# EAGLE design mowgli-mem (EAGLE 7.6.0)
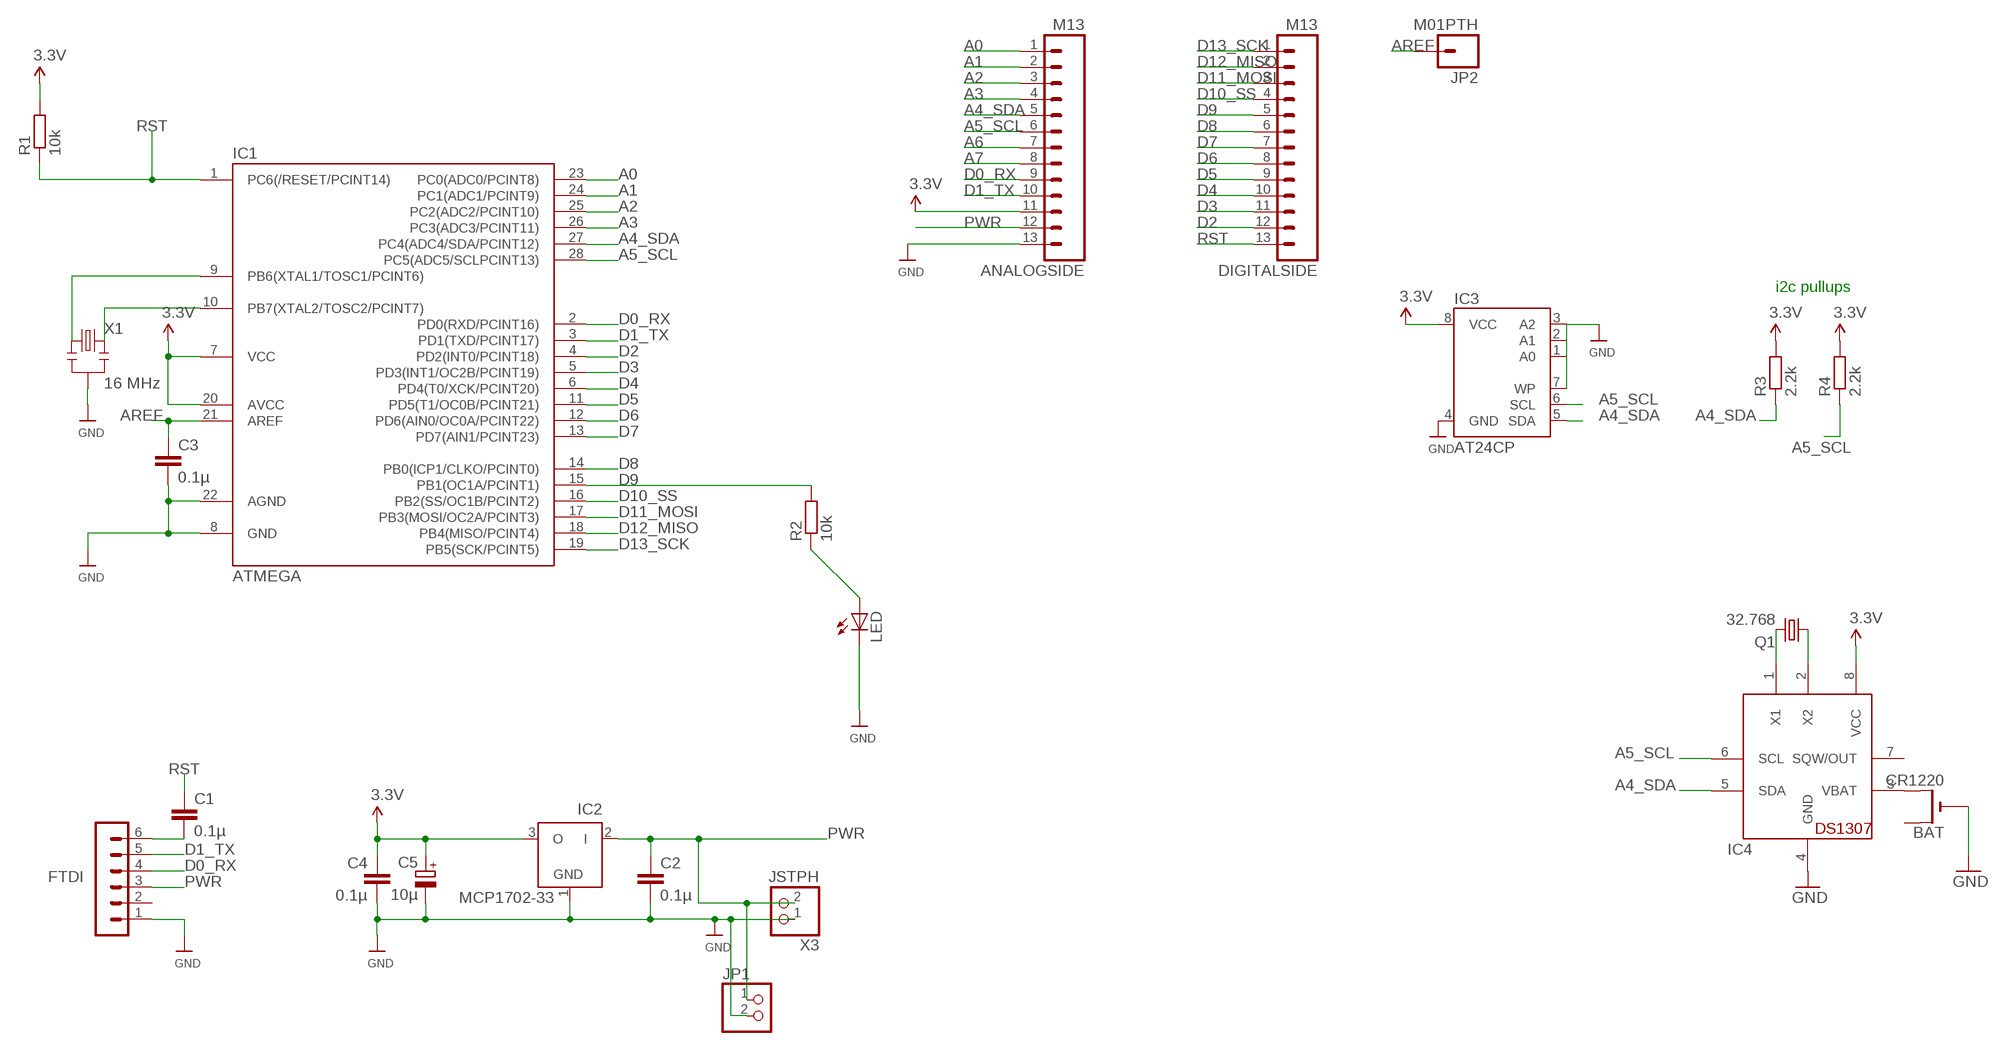
[diagram p0: schematic, sheet 1]

## Parts
ANALOGSIDE  M13  [1X13]
BAT  CR1220  CR1220THM  [CR1220-THM]
C1  0.1µ  C-EU025-024X044  [C025-024X044]
C2  0.1µ  C-EU025-024X044  [C025-024X044]
C3  0.1µ  C-EU025-024X044  [C025-024X044]
C4  0.1µ  C-EU025-024X044  [C025-024X044]
C5  10µ  CPOL-EUE1.8-4  [E1,8-4]
DIGITALSIDE  M13  [1X13]
FTDI  FTDI  MA06-1  [MA06-1]
IC1  ATMEGA  ATMEGA48/88/168-PU  [DIL28-3]
IC2  MCP1702-33  MCP1702Z  [TO92]
IC3  AT24CP  [DIL08]
IC4  DS1307  [DIL08]
JP1  PINHD-1X2  [1X02]
JP2  M01PTH  [1X01]
LED  LED3MM  [LED3MM]
Q1  32.768  CRYTALTC38H  [TC38H]
R1  10k  R-EU_0204/7  [0204/7]
R2  10k  R-EU_0204/7  [0204/7]
R3  2.2k  R-EU_0204/7  [0204/7]
R4  2.2k  R-EU_0204/7  [0204/7]
X1  16 MHz  RESONATORPTH  [RESONATOR-PTH]
X3  JSTPH  CON_JST_PH_2PIN  [JSTPH2]

## Nets
A0: ANALOGSIDE.1 IC1.23(PC0(ADC0/PCINT8))
A1: ANALOGSIDE.2 IC1.24(PC1(ADC1/PCINT9))
A2: ANALOGSIDE.3 IC1.25(PC2(ADC2/PCINT10))
A3: ANALOGSIDE.4 IC1.26(PC3(ADC3/PCINT11))
A4_SDA: ANALOGSIDE.5 IC1.27(PC4(ADC4/SDA/PCINT12)) IC3.5(SDA) IC4.5(SDA) R3.1
A5_SCL: ANALOGSIDE.6 IC1.28(PC5(ADC5/SCLPCINT13)) IC3.6(SCL) IC4.6(SCL) R4.1
A6: ANALOGSIDE.7
A7: ANALOGSIDE.8
AREF: C3.1 IC1.21(AREF) JP2.1
D0_RX: ANALOGSIDE.9 FTDI.4 IC1.2(PD0(RXD/PCINT16))
D1_TX: ANALOGSIDE.10 FTDI.5 IC1.3(PD1(TXD/PCINT17))
D2: DIGITALSIDE.12 IC1.4(PD2(INT0/PCINT18))
D3: DIGITALSIDE.11 IC1.5(PD3(INT1/OC2B/PCINT19))
D4: DIGITALSIDE.10 IC1.6(PD4(T0/XCK/PCINT20))
D5: DIGITALSIDE.9 IC1.11(PD5(T1/OC0B/PCINT21))
D6: DIGITALSIDE.8 IC1.12(PD6(AIN0/OC0A/PCINT22))
D7: DIGITALSIDE.7 IC1.13(PD7(AIN1/PCINT23))
D8: DIGITALSIDE.6 IC1.14(PB0(ICP1/CLKO/PCINT0))
D9: DIGITALSIDE.5 IC1.15(PB1(OC1A/PCINT1)) R2.2
D10_SS: DIGITALSIDE.4 IC1.16(PB2(SS/OC1B/PCINT2))
D11_MOSI: DIGITALSIDE.3 IC1.17(PB3(MOSI/OC2A/PCINT3))
D12_MISO: DIGITALSIDE.2 IC1.18(PB4(MISO/PCINT4))
D13_SCK: DIGITALSIDE.1 IC1.19(PB5(SCK/PCINT5))
GND [power]: ANALOGSIDE.13 BAT.- C2.2 C3.2 C4.2 C5.- FTDI.1 IC1.8(GND) IC1.22(AGND) IC2.1(GND) IC3.1(A0) IC3.2(A1) IC3.3(A2) IC3.4(GND) IC3.7(WP) IC4.4(GND) JP1.2 LED.K(C) X1.2 X3.1
N$1: IC1.9(PB6(XTAL1/TOSC1/PCINT6)) X1.1
N$2: LED.A R2.1
N$14: IC4.1(X1) Q1.2
N$15: IC4.2(X2) Q1.1
N$20: C1.2 FTDI.6
N$21: IC1.10(PB7(XTAL2/TOSC2/PCINT7)) X1.3
N$39: BAT.+2(+1) IC4.3(VBAT)
PWR [power]: ANALOGSIDE.12 C2.1 FTDI.3 IC2.2(I) JP1.1 X3.2
RST: C1.1 DIGITALSIDE.13 IC1.1(PC6(/RESET/PCINT14)) R1.1
VCC [power]: ANALOGSIDE.11 C4.1 C5.+ IC1.7(VCC) IC1.20(AVCC) IC2.3(O) IC3.8(VCC) IC4.8(VCC) R1.2 R3.2 R4.2 ; supply symbol labelled 3.3V
Unconnected: BAT.+1(+) FTDI.2 IC4.7(SQW/OUT)

## Notes on the sheet
- i2c pullups

## Library data of the parts
ANALOGSIDE DIGITALSIDE = SparkFun-Connectors:M13: 13-pin single row .1" header
BAT = adafruit:CR1220: CR1216/CR1220/CR1225 12mm 3V lithium coin cell Great for battery packup. Both SMT and THM holders. Note the THM package has the ground pads on both sides of the PCB so that the masks are the same - this reduces the cost
C1-C4 = resistor:C-EU: CAPACITOR, European symbol
C5 = resistor:CPOL-EU: POLARIZED CAPACITOR, European symbol
FTDI = JeeLabs:MA06-1: PIN HEADER
IC1 = atmega8:ATMEGA48/88/168-PU
IC2 = JeeLabs:MCP1702: 200 mA, Low Power Low Dropout Voltage Regulator
IC3 = atmel:AT24C*: 2-wire serial EEPROM; MPN: AT24C1024BW-SH-B; OC_FARNELL: 1362646; OC_NEWARK: 03P2044
IC4 = adafruit:DS1307: DS1307 Real time clock (RTC) with battery backup ability. Talk to it via i2c
JP1 = pinhead:PINHD-1X2: PIN HEADER
JP2 = SparkFun-Connectors:M01: Header 1 Standard 1-pin 0.1" header. Use with straight break away headers (SKU : PRT-00116), right angle break away headers (PRT-00553), swiss pins (PRT-00743), machine pins (PRT-00117), and female headers (PRT-00115).
LED = led:LED: LED OSRAM: - CHIPLED LG R971, LG N971, LY N971, LG Q971, LY Q971, LO R971, LY R971 LH N974, LH R974 LS Q976, LO Q976, LY Q976 LO Q996 - Hyper CHIPLED LW Q18S LB Q993, LB Q99A, LB R99A - SideLED LS A670, LO A670, LY A670, LG A670, LP A670 LB A673, LV A673, LT A673, LW A673 LH A674 LY A675 LS A676, LA A676, LO A676, LY A676, LW A676 LS A679, LY A679, LG A679 - Hyper Micro SIDELED® LS Y876, LA Y876, LO Y876, LY Y876 LT Y87S - SmartLED LW L88C, LW L88S LB L89C, LB L89S, LG L890 LS L89K, LO L89K, LY L89K LS L896, LA L896, LO L896, LY L896 - TOPLED LS T670, LO T670, LY T670, LG T670, LP T670 LSG T670, LSP T670, LSY T670, LOP T670, LYG T670 LG T671, LOG T671, LSG T671 LB T673, LV T673, LT T673, LW T673 LH T674 LS T676, LA T676, LO T676, LY T676, LB T676, LH T676, LSB T676, LW T676 LB T67C, LV T67C, LT T67C, LS T67K, LO T67K, LY T67K, LW E67C LS E67B, LA E67B, LO E67B, LY E67B, LB E67C, LV E67C, LT E67C LW T67C LS T679, LY T679, LG T679 LS T770, LO T770, LY T770, LG T770, LP T770 LB T773, LV T773, LT T773, LW T773 LH T774 LS E675, LA E675, LY E675, LS T675 LS T776, LA T776, LO T776, LY T776, LB T776 LHGB T686 LT T68C, LB T68C - Hyper Mini TOPLED® LB M676 - Mini TOPLED Santana® LG M470 LS M47K, LO M47K, LY M47K Source: http://www.osram.convergy.de LUXEON: - LUMILED® LXK2-PW12-R00, LXK2-PW12-S00, LXK2-PW14-U00, LXK2-PW14-V00 LXK2-PM12-R00, LXK2-PM12-S00, LXK2-PM14-U00 LXK2-PE12-Q00, LXK2-PE12-R00, LXK2-PE12-S00, LXK2-PE14-T00, LXK2-PE14-U00 LXK2-PB12-K00, LXK2-PB12-L00, LXK2-PB12-M00, LXK2-PB14-N00, LXK2-PB14-P00, LXK2-PB14-Q00 LXK2-PR12-L00, LXK2-PR12-M00, LXK2-PR14-Q00, LXK2-PR14-R00 LXK2-PD12-Q00, LXK2-PD12-R00, LXK2-PD12-S00 LXK2-PH12-R00, LXK2-PH12-S00 LXK2-PL12-P00, LXK2-PL12-Q00, LXK2-PL12-R00 Source: www.luxeon.com KINGBRIGHT: KA-3528ASYC Source: www.kingbright.com
Q1 = crystal:CRYTAL: CRYSTAL
R1-R4 = resistor:R-EU_: RESISTOR, European symbol
X1 = SparkFun:RESONATOR: Resonator Small SMD resonator. This is the itty bitty 10/20MHz resonators with built in caps. CSTCE10M0G55 and CSTCE20M0V53. Footprint has been reviewed closely but hasn't been tested yet.
X3 = microbuilder:CON_JST_PH_2PIN: JST 2-Pin Right-Angle Connector PH-Series - 4UConnector: 17311 SH-Series - 4UConnector: 07278

## Net classes
1 power: width 0.381 mm, clearance 0.254 mm

## Board
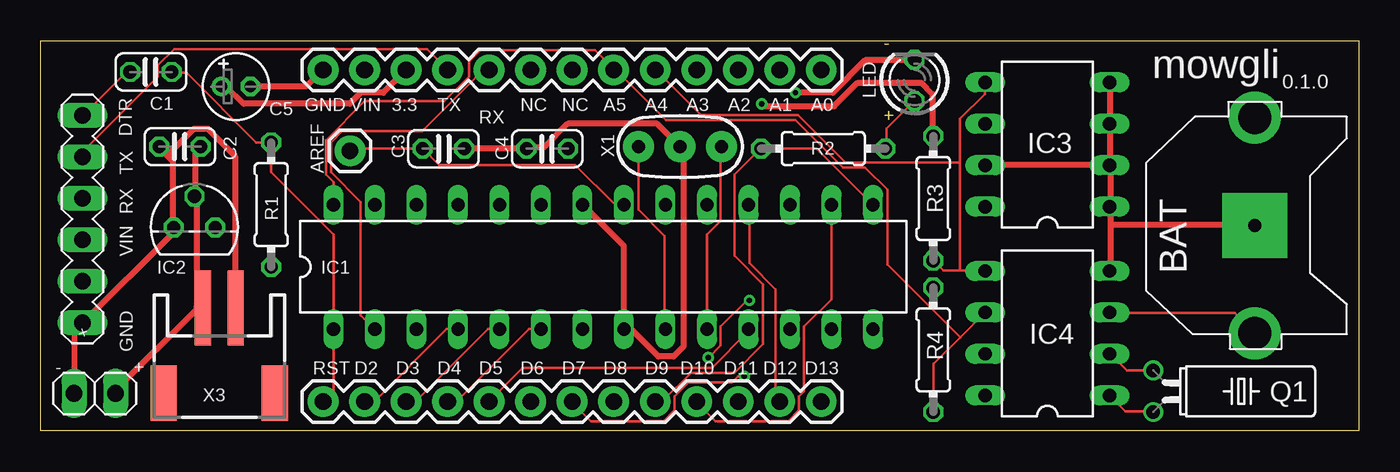
[diagram p1: board, top side]
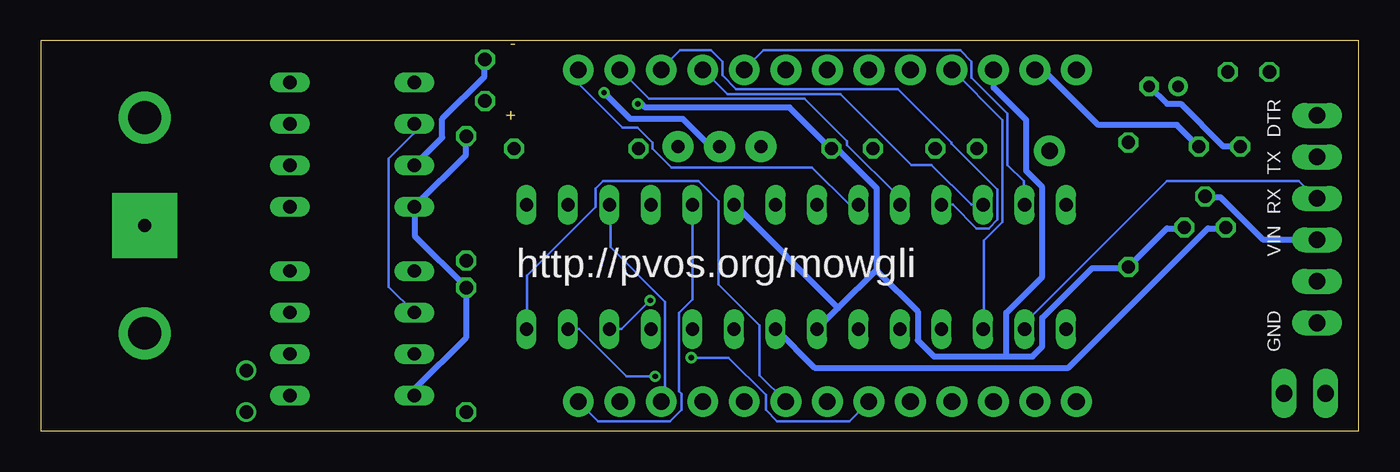
[diagram p2: board, bottom side, seen from below]

Size 80.64 x 23.88 mm. Coordinates in mm from the lower left corner, seen from the top.
Outline: 0,0 0,23.88 80.64,23.88 80.64,0 0,0
Copper layers (1*16): Top 0.0356mm / dielectric 1.5011mm / Bottom 0.0356mm
Design rules "LaenPCBOrder": minimum track width 6mil, minimum drill 13mil, track to track 6mil, track to pad 6mil, pad to pad 6mil, via to via 6mil, smd to smd 6mil, copper to edge 15mil, drill to drill 6mil, minimum pad ring 7mil, minimum via ring 7mil, stop-mask expansion 3mil, vias tented up to drill 0mil, thermal gap 10mil

### Footprints (pad centres in the part's own frame; a part is rotated, then mirrored left to right if it is on the bottom)
1X13 = drill 1.016 pad 1.88: 1 0,0; 2 2.54,0; 3 5.08,0; 4 7.62,0; 5 10.16,0; 6 12.7,0; 7 15.24,0; 8 17.78,0; 9 20.32,0; 10 22.86,0; 11 25.4,0; 12 27.94,0; 13 30.48,0
CR1220-THM = drill 2 pad 3.175: +1 -6.604,0; +2 6.604,0 | drill 0.8 pad 3.962 square: - 0,0
C025-024X044 = drill 0.813 octagon: 1 -1.27,0; 2 1.27,0
E1,8-4 = drill 0.711 pad 1.168: + -0.889,0 | drill 0.711 pad 1.168 octagon: - 0.889,0
MA06-1 = drill 1.016 long: 1 0,0; 2 2.54,0; 3 5.08,0; 4 7.62,0; 5 10.16,0; 6 12.7,0
DIL28-3 = drill 0.813 long: 1 -16.51,-3.81; 2 -13.97,-3.81; 3 -11.43,-3.81; 4 -8.89,-3.81; 5 -6.35,-3.81; 6 -3.81,-3.81; 7 -1.27,-3.81; 8 1.27,-3.81; 9 3.81,-3.81; 10 6.35,-3.81; 11 8.89,-3.81; 12 11.43,-3.81; 13 13.97,-3.81; 14 16.51,-3.81; 15 16.51,3.81; 16 13.97,3.81; 17 11.43,3.81; 18 8.89,3.81; 19 6.35,3.81; 20 3.81,3.81; 21 1.27,3.81; 22 -1.27,3.81; 23 -3.81,3.81; 24 -6.35,3.81; 25 -8.89,3.81; 26 -11.43,3.81; 27 -13.97,3.81; 28 -16.51,3.81
TO92 = drill 0.813 octagon: 1 -1.27,0; 2 0,1.905; 3 1.27,0
DIL08 = drill 0.813 long: 1 -3.81,-3.81; 2 -1.27,-3.81; 3 1.27,-3.81; 4 3.81,-3.81; 5 3.81,3.81; 6 1.27,3.81; 7 -1.27,3.81; 8 -3.81,3.81
1X02 = drill 1.016 long: 1 -1.27,0; 2 1.27,0
1X01 = drill 1.016 pad 1.88: 1 0,0
LED3MM = drill 0.813 octagon: A -1.27,0; K 1.27,0
TC38H = drill 0.813: 1 -1.27,0; 2 1.27,0
0204/7 = drill 0.813 octagon: 1 -3.81,0; 2 3.81,0
RESONATOR-PTH = drill 0.8 pad 1.88: 1 -2.54,0; 2 0,0; 3 2.54,0
JSTPH2 = smd 1 x 4.6: 1 -1,-3.7; 2 1,-3.7 | smd 1.6 x 3.4: NC1 -3.4,1.5; NC2 3.4,1.5

### Placement (x,y rotation side)
ANALOGSIDE  47.75,22.1 180 top
BAT  74.3,12.57 270 top
C1  6.73,21.97 180 top
C2  8.51,17.4 180 top
C3  24.64,17.27 0 top
C4  30.99,17.27 180 top
C5  11.94,21.08 0 top
DIGITALSIDE  47.75,1.78 180 top
FTDI  2.54,6.6 90 top
IC1  34.42,10.03 0 top
IC2  9.4,12.45 0 top
IC3  61.59,17.53 90 top
IC4  61.59,5.97 90 top
JP1  3.3,2.29 180 top
JP2  18.92,17.14 0 top
LED  53.47,21.46 90 top
Q1  68.07,2.41 270 top
R1  14.1,13.84 270 top
R2  47.88,17.27 180 top
R3  54.61,14.22 90 top
R4  54.61,4.95 90 top
X1  39.12,17.4 0 top
X3  10.92,3.81 180 top

### Tracks (layer width: path | path; a pad name or v marks a point on that pad's centre or on a via)
A0
  Bottom 0.152: IC1.23 31.17,13.84 33.45,16.13 42.06,16.13 43.2,17.27 43.2,17.65 44.12,18.57 45.03,18.57 47.7,21.23 47.7,22.07 ANALOGSIDE.1
A1
  Bottom 0.152: ANALOGSIDE.2 43.43,20.32 33.91,20.32 31.32,17.73 31.32,17.5 28.12,14.3 28.12,13.84 IC1.24
A2
  Bottom 0.152: IC1.25 24.84,13.84 23.39,12.39 22.63,12.39 22.1,12.93 22.1,14.76 24.92,17.58 24.92,17.65 28.19,20.93 38.1,20.93 38.94,21.77 38.94,22.61 39.62,23.29 41.53,23.29 42.67,22.15 ANALOGSIDE.3
A3
  Bottom 0.152: IC1.26 23.7,13.84 26.14,16.28 27.36,16.28 31.7,20.62 38.63,20.62 40.08,22.07 ANALOGSIDE.4
A4_SDA
  Top 0.152: 56.24,9.8 55.24,9.8 54.63,10.41 R3.1 | 56.24,9.8 57.76,9.8 IC4.5 | 56.24,9.8 56.24,16.43 | 56.24,16.43 56.24,19.1 57.76,20.62 57.76,21.31 IC3.5 | 56.24,16.43 49.23,16.43 46.33,19.33 40.39,19.33 37.64,22.07 ANALOGSIDE.5
  Bottom 0.152: IC1.27 20.5,13.84 20.5,15.29 21.49,16.28 21.49,19.41 23.7,21.61 23.7,22.61 24.38,23.29 36.42,23.29 37.57,22.15 ANALOGSIDE.5
A5_SCL
  Top 0.152: IC4.6 56.27,5.73 | 56.27,5.73 54.63,4.09 54.63,1.19 R4.1 | IC1.28 17.91,15.21 17.45,15.67 17.45,17.8 19.81,20.17 24.69,20.17 26.21,21.69 26.21,22.61 26.9,23.29 33.91,23.29 35.05,22.15 ANALOGSIDE.6 35.05,22.22 38.25,19.02 46.18,19.02 49.07,16.13 50.44,16.13 51.82,14.76 51.82,10.18 56.27,5.73
  Bottom 0.152: IC4.6 59.36,8.81 59.36,16.66 57.84,18.19 57.84,18.8 IC3.6
AREF
  Top 0.152: JP2.1 19.05,17.27 C3.1 23.39,17.27 24.38,16.28 32.69,16.28 35.13,13.84 IC1.21
D0_RX
  Top 0.152: ANALOGSIDE.9 27.43,22.07 27.05,22.07 23.32,18.34 18.44,18.34 17.75,17.65 17.75,15.82 19.58,14 19.58,7.06 20.42,6.22 IC1.2
  Bottom 0.152: IC1.2 20.42,6.22 20.42,6.6 11.74,15.29 3.66,15.29 2.59,14.22 FTDI.4
D1_TX
  Top 0.152: ANALOGSIDE.10 23.62,23.37 8.15,23.37 7.16,22.38 7.16,21.69 2.59,17.12 2.59,16.81 FTDI.5
  Bottom 0.152: IC1.3 22.94,6.22 22.94,11.63 21.79,12.78 21.79,19.02 24.84,22.07 ANALOGSIDE.10
D2
  Top 0.152: IC1.4 24.84,6.22 20.42,1.8 19.81,1.8 DIGITALSIDE.12
D3
  Top 0.152: IC1.5 27.36,6.22 22.94,1.8 22.4,1.8 DIGITALSIDE.11
D4
  Top 0.152: IC1.6 29.87,6.22 25.45,1.8 24.92,1.8 DIGITALSIDE.10
D5
  Top 0.152: IC1.11 43.28,6.22 43.28,6.07 41.07,3.86 29.49,3.86 27.43,1.8 DIGITALSIDE.9
D6  (via drill 0.33)
  Top 0.152: v43.36,7.98 43.2,7.98 41.61,6.38 41.61,5.23 v40.84,4.47
  Bottom 0.152: IC1.12 45.11,6.22 v43.36,7.98 | v40.84,4.47 38.56,4.47 36.27,2.18 36.27,1.27 35.59,0.58 31.17,0.58 DIGITALSIDE.8
D7  (via drill 0.33)
  Top 0.152: v43.05,3.33 42.67,3.33 42.29,2.95 39.62,2.95 38.79,2.11 38.79,1.27 38.1,0.58 33.68,0.58 32.54,1.73 DIGITALSIDE.7
  Bottom 0.152: IC1.13 47.7,6.22 44.81,3.33 v43.05,3.33
D8
  Bottom 0.152: IC1.14 50.9,6.22 50.9,9.5 46.71,13.69 46.71,14.83 46.25,15.29 40.39,15.29 39.17,14.07 39.17,8.97 36.65,6.45 36.65,3.4 35.05,1.8 DIGITALSIDE.6
D9
  Top 0.152: IC1.15 50.9,13.84 47.47,17.27 R2.2 44.04,17.27 42.44,15.67 42.44,10.72 44.2,8.97 44.2,5.31 42.44,3.56 39.78,3.56 38.02,1.8 37.64,1.8 DIGITALSIDE.5
D10_SS
  Top 0.152: IC1.16 48.39,8.05 46.71,6.38 46.71,2.41 46.41,2.11 46.41,1.27 45.72,0.58 41.3,0.58 40.16,1.73 DIGITALSIDE.4
D11_MOSI
  Bottom 0.152: IC1.17 45.8,13.84 45.8,11.25 42.44,7.9 42.44,2.03 42.67,1.8 DIGITALSIDE.3
D12_MISO
  Top 0.152: DIGITALSIDE.2 44.96,2.03 44.96,8.66 43.36,10.26 43.36,13.84 IC1.18
D13_SCK
  Bottom 0.152: IC1.19 40.77,8.05 41.61,7.21 41.61,2.41 41.45,2.26 41.45,1.27 42.14,0.58 46.56,0.58 DIGITALSIDE.1
GND  (via drill 0.33)
  Top 0.381: JP1.2 2.06,2.34 2.06,6.15 2.51,6.6 FTDI.1 2.67,6.68 8,12.01 8,12.32 IC2.1 8.08,12.47 8.08,16.51 7.73,16.85 | 7.73,16.85 7.24,17.35 C2.2 | C5.- 16.23,21.08 17.22,22.07 ANALOGSIDE.13 | 7.73,16.85 9.37,18.49 10.21,18.49 11.89,16.81 11.89,7.52 X3.1 | IC1.22 35.66,11.33 35.66,6.22 IC1.8 35.81,6.15 36.2,6.15 37.8,4.55 38.71,4.55 39.32,5.16 39.32,17.2 X1.2 37.72,18.8 32.23,18.8 30.79,17.35 29.87,17.35 C4.2 C3.2 | 65.46,12.62 65.46,13.69 IC3.1 65.46,13.84 65.46,16.13 IC3.2 | 65.46,12.62 65.46,9.8 IC4.4 | IC3.7 57.84,16.28 65.38,16.28 IC3.2 | IC3.2 65.46,16.43 65.46,18.8 IC3.3 65.46,18.95 65.46,21.31 IC3.4 | 65.46,12.62 74.3,12.62 BAT.- | v46.18,20.7 48.46,20.7 50.44,22.68 53.42,22.68 LED.K
  Bottom 0.381: C2.2 7.24,17.42 8.31,17.42 10.9,20.02 11.74,20.02 12.8,21.08 C5.- | IC3.7 56.08,17.96 56.08,19.1 53.49,21.69 53.49,22.68 LED.K | v46.18,20.7 44.58,19.1 41.38,19.1 39.7,17.42 39.17,17.42 X1.2 | IC2.1 8.15,12.39 9.22,12.39 17.75,3.86 33.3,3.86 35.66,6.22 IC1.8
N$1
  Top 0.152: X1.1 36.58,13.54 38.18,11.94 38.18,6.22 IC1.9
N$2
  Top 0.152: R2.1 51.74,17.27 51.74,18.49 53.42,20.17 LED.A
N$14
  Top 0.152: IC4.1 66.37,1.19 68.05,1.19 Q1.2
N$15
  Top 0.152: Q1.1 68.05,3.71 66.45,3.71 65.46,4.7 IC4.2
N$20
  Top 0.152: C1.2 5.41,21.92 5.18,21.92 2.59,19.33 FTDI.6
N$21
  Top 0.152: IC1.10 40.77,12.01 41.61,12.85 41.61,17.35 X1.3
N$39
  Top 0.152: IC4.3 65.46,7.21 73.08,7.21 74.3,5.99 BAT.+2
PWR
  Top 0.381: JP1.1 4.57,2.49 9.53,7.44 9.91,7.44 X3.2 9.53,7.59 9.53,14.22 IC2.2 9.45,14.38 9.45,17.04 9.75,17.35 C2.1
  Bottom 0.381: FTDI.3 2.59,11.71 5.87,11.71 8.46,14.3 9.37,14.3 IC2.2 | ANALOGSIDE.12 19.81,22.07 19.28,22.07 15.93,18.72 11.12,18.72 9.83,17.42 C2.1
RST
  Top 0.152: DIGITALSIDE.13 17.91,2.41 IC1.1 17.91,12.01 14.1,15.82 R1.1 13.18,17.65 8.92,21.92 8,21.92 C1.1
VCC  (via drill 0.33)
  Top 0.381: C5.+ 11.35,21.08 12.42,20.02 18.9,20.02 19.58,20.7 20.96,20.7 ANALOGSIDE.11 | v44.12,20.02 44.27,19.86 48.54,19.86 49.99,21.31 53.87,21.31 54.56,20.62 54.56,18.03 R3.2
  Bottom 0.381: IC4.8 57.76,2.18 57.76,2.56 54.63,5.69 54.63,8.59 R4.2 54.63,8.81 57.76,11.94 57.76,13.69 IC3.8 57.68,13.84 54.63,16.89 54.63,18.03 R3.2 | IC2.3 10.67,12.39 11.74,12.39 R1.2 14.25,9.96 16.31,9.96 19.36,6.91 19.36,5.16 19.96,4.55 21.57,4.55 | 29.49,9.88 29.49,14.83 31.93,17.27 C4.1 32.38,17.35 34.82,19.79 43.66,19.79 43.89,20.02 v44.12,20.02 | IC1.7 31.85,7.52 | 31.85,7.52 29.49,9.88 | 31.85,7.52 38.18,13.84 IC1.20 | 21.57,4.55 25.98,4.55 26.98,5.54 26.98,7.29 29.41,9.73 29.49,9.88 | 21.57,4.55 21.57,7.21 19.36,9.42 19.36,14.91 20.34,15.9 20.34,19.02 22.33,21.01 22.33,22.07 ANALOGSIDE.11

### Text on the board
Dimension: - | +
tPlace: mowgli | 0.1.0
bPlace: http://pvos.org/mowgli
tNames: LED | C1 | C5 | GND | VIN | 3.3 | TX | NC | NC | A5 | A4 | A3 | A2 | A1 | A0 | DTR | C2 | AREF | C3 | RX | C4 | X1 | TX | R2 | RX | R1 | VIN | IC2 | IC1 | GND | + | - | + | RST | D2 | D3 | D4 | D5 | D6 | D7 | D8 | D9 | D10 | D11 | D12 | D13 | X3
bNames: DTR | TX | RX | VIN | GND